# Altium schematic sheet TEMP.SchDoc
size A4
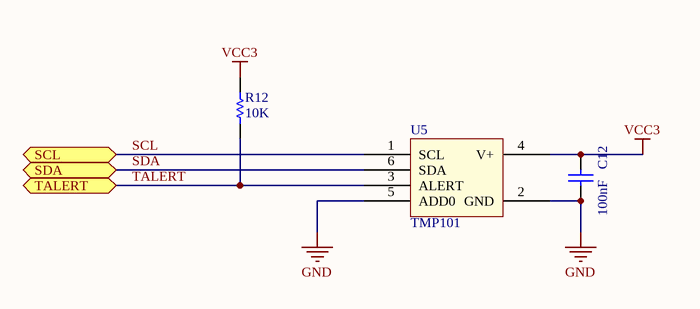
[diagram p0: TEMP.SchDoc]

## Parts
C12  value 100nF  [RESC2012L]  (hidden comment: Cap Semi)
R12  value 10K  [RES0805]  (hidden comment: Res Semi)
U5  TMP101  [SOT23-6_L]

## Ports
SCL, SDA, TALERT

## Nets
GND: C12.1 U5.2(GND) U5.5(ADD0)
VCC3: C12.2 R12.2 U5.4(V+)
SCL: U5.1(SCL) ; port SCL
SDA: U5.6(SDA) ; port SDA
TALERT: R12.1 U5.3(ALERT) ; port TALERT

## Library data of the parts
C12 = Cap Semi: Capacitor (Semiconductor SIM Model); Published: 8-Jun-2000; LatestRevisionDate: 29-May-2009; LatestRevisionNote: IPC-7351 Footprint Added.; PackageReference: C1206; Publisher: Altium Limited; PackageDescription: Chip Capacitor
R12 = Res Semi: Semiconductor Resistor; Published: 8-Jun-2000; LatestRevisionDate: 17-Jul-2002; LatestRevisionNote: Re-released for DXP Platform.; PackageReference: AXIAL-0.5; Publisher: Altium Limited; PackageDescription: Axial Device, Thru-Hole; 2 Leads; 0.5 in Pin Spacing
U5 = TMP101: I2C Temperature Sensor